# Altium schematic sheet circuit_BLDCControl.SchDoc
size 420 x 297 mm; Address1: Address1; Address2: Address2; Address3: Address3; Address4: Address4; SheetNumber: 1; Scale: 1:1; Разраб.: Лепотенко А.С.; Обозначение документа: ЛАС.42853.001Э3; Перв. применение: ЛАС.42853.001Э3; Наименование изделия 1: Блок управления BLDC; Наименование изделия 2: Схема электрическая; Наименование изделия 3: принципиальная; Нач. отд.: Нач. отд.
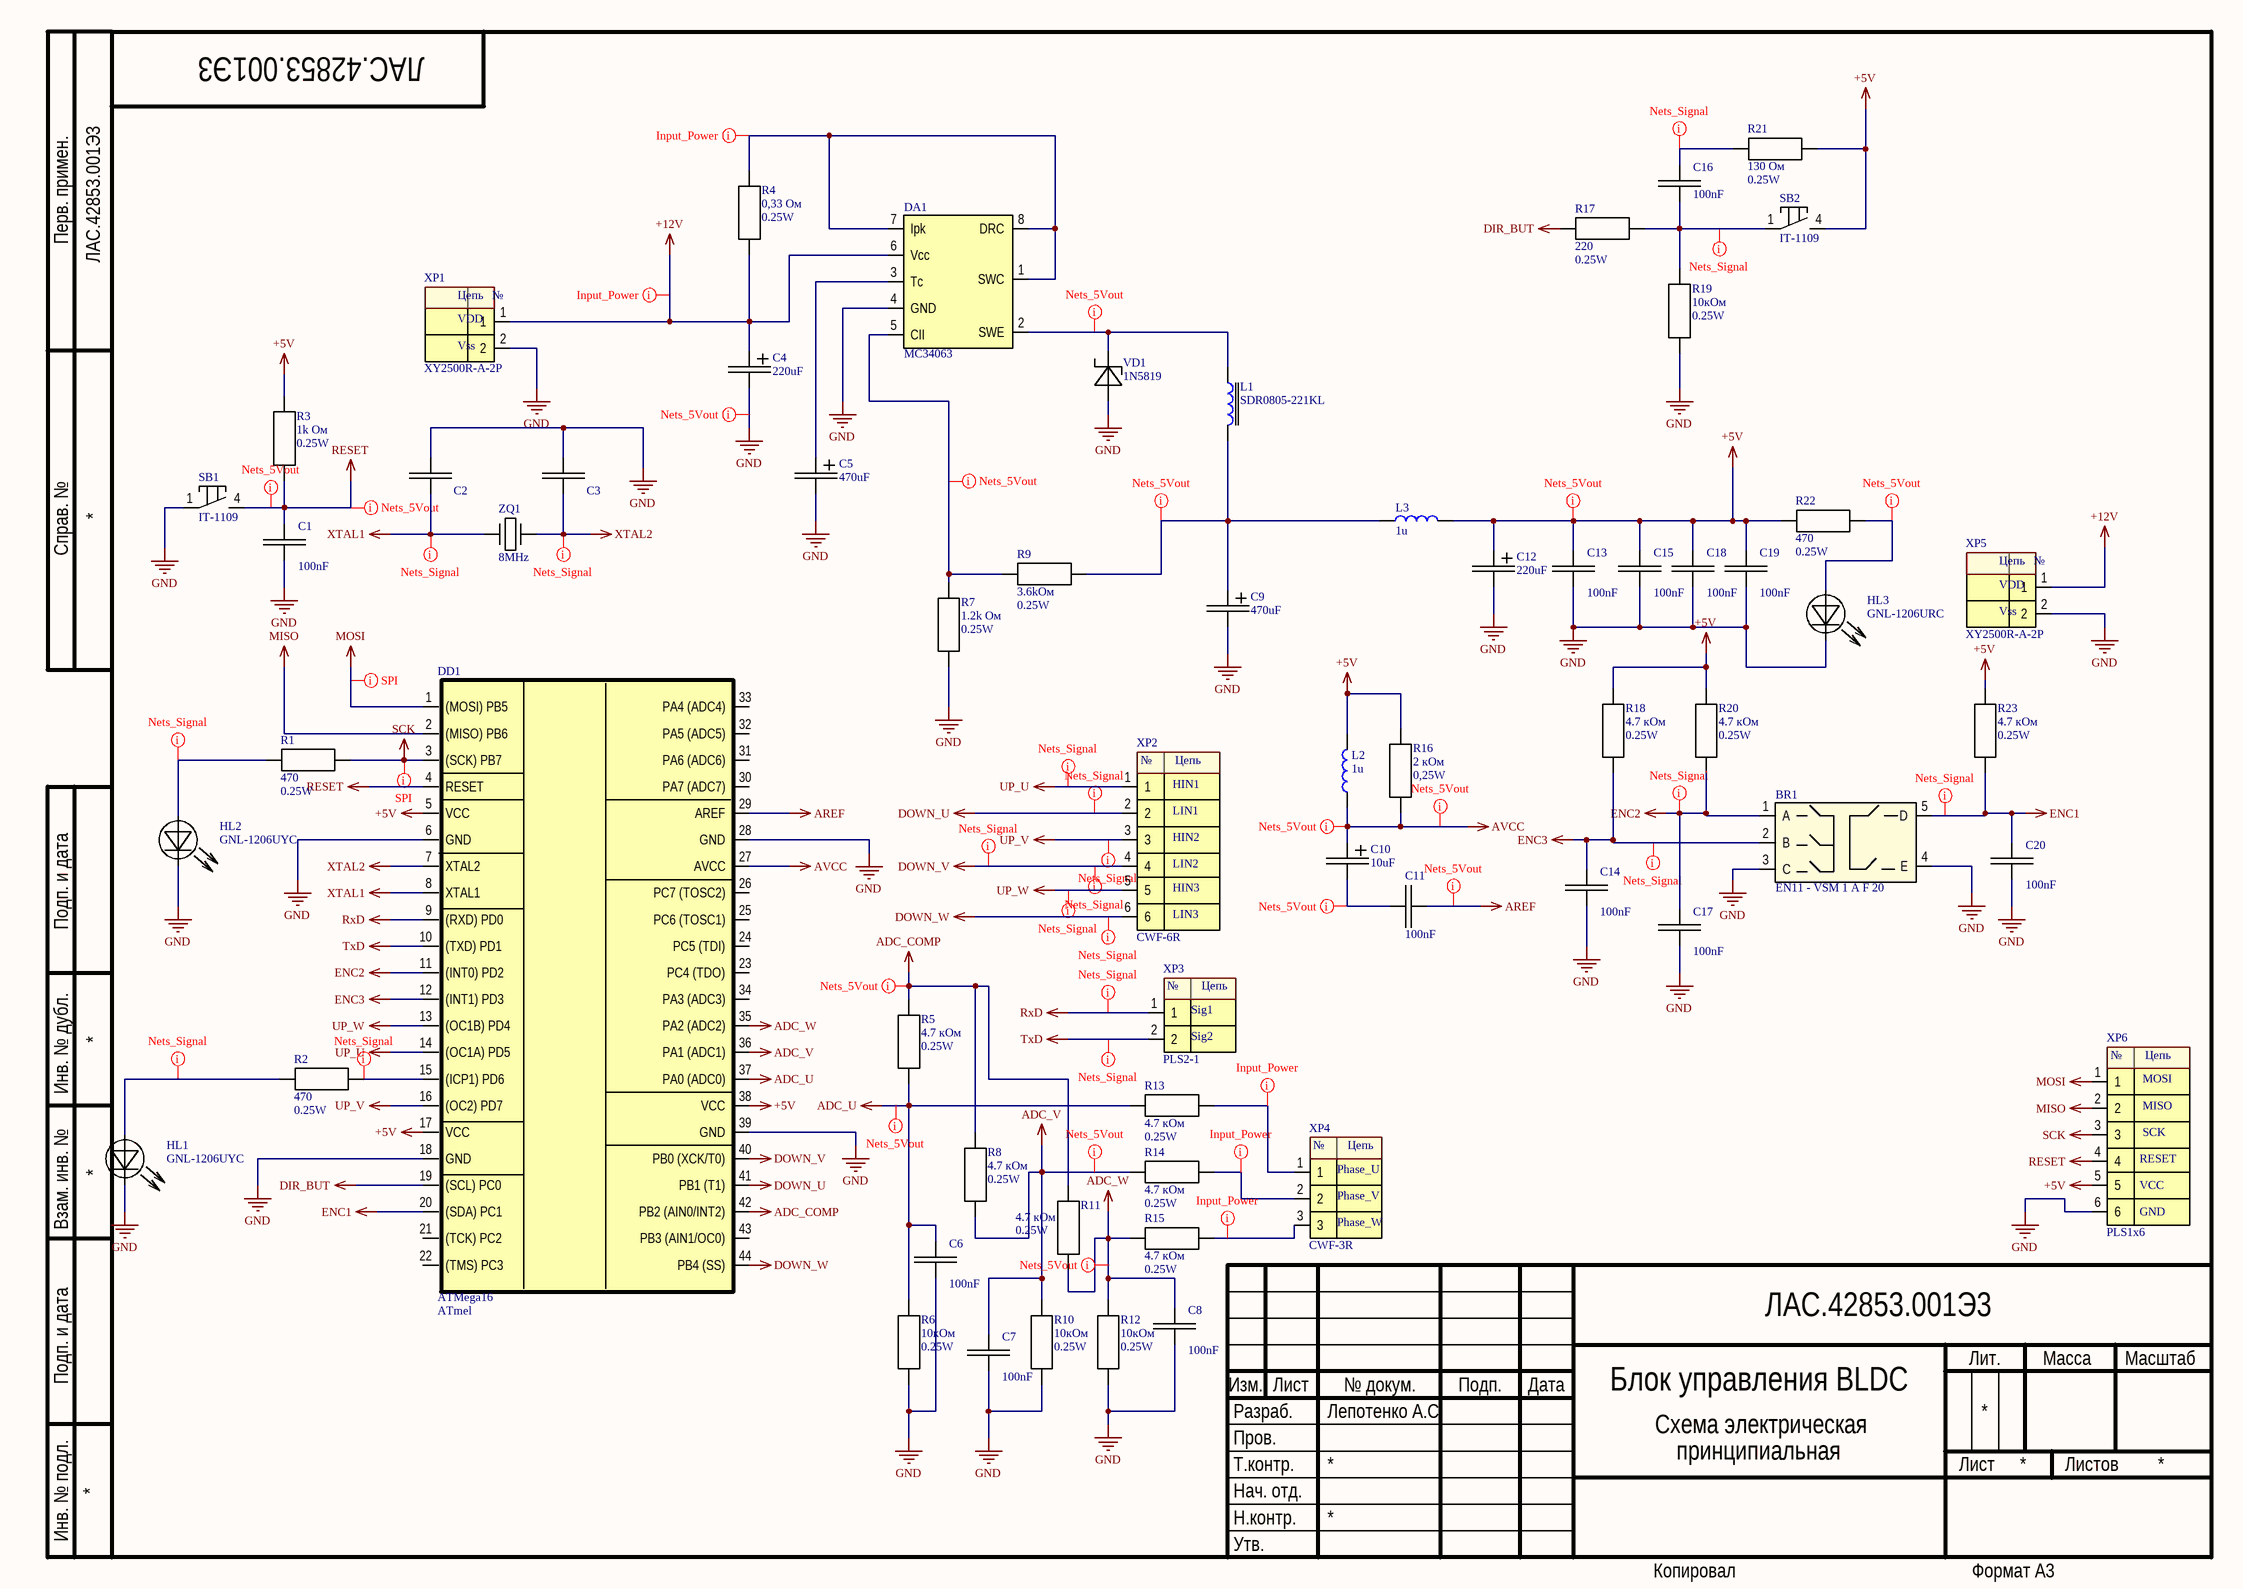
[diagram p0: circuit_BLDCControl.SchDoc]

## Parts
BR1  EN11 - VSM 1 A F 20  [EN11-HSM]
C1  100nF  [CAP1206]
C2  22pF  [CAP1206]  (value not drawn)
C3  22pF  [CAP1206]  (value not drawn)
C4  220uF  [CAPAE120103X105MTypeG]
C5  470uF  [CAPAE120103X105MTypeG]
C6  100nF  [CAP1206]
C7  100nF  [CAP1206]
C8  100nF  [CAP1206]
C9  470uF  [CAPAE120103X105MTypeG]
C10  10uF  [Type D]
C11  100nF  [CAP1206]
C12  220uF  [CAPAE120103X105MTypeG]
C13  100nF  [CAP1206]
C14  100nF  [CAP1206]
C15  100nF  [CAP1206]
C16  100nF  [CAP1206]
C17  100nF  [CAP1206]
C18  100nF  [CAP1206]
C19  100nF  [CAP1206]
C20  100nF  [CAP1206]
DA1  MC34063  [SO-8]
DD1  Manufacturer: ATmel  [TQFP80P1200X1200X120-44N]  (hidden comment: ATMega16)
HL1  GNL-1206UYC  [LED1206]
HL2  GNL-1206UYC  [LED1206]
HL3  GNL-1206URC  [LED1206]
L1  SDR0805-221KL  [SDR0805]
L2  1u  [LQG15HN15NJ]
L3  1u  [LQG15HN15NJ]
R1  Power: 0.25W  [1206]  (hidden comment: 470)
R2  Power: 0.25W  [1206]  (hidden comment: 470)
R3  Power: 0.25W  [1206]  (hidden comment: 1k Ом)
R4  Power: 0.25W  [1206]  (hidden comment: 0,33 Ом)
R5  Power: 0.25W  [1206]  (hidden comment: 4.7 кОм)
R6  Power: 0.25W  [1206]  (hidden comment: 10кОм)
R7  Power: 0.25W  [1206]  (hidden comment: 1.2k Ом)
R8  Power: 0.25W  [1206]  (hidden comment: 4.7 кОм)
R9  Power: 0.25W  [1206]  (hidden comment: 3.6kОм)
R10  Power: 0.25W  [1206]  (hidden comment: 10кОм)
R11  Power: 0.25W  [1206]  (hidden comment: 4.7 кОм)
R12  Power: 0.25W  [1206]  (hidden comment: 10кОм)
R13  Power: 0.25W  [1206]  (hidden comment: 4.7 кОм)
R14  Power: 0.25W  [1206]  (hidden comment: 4.7 кОм)
R15  Power: 0.25W  [1206]  (hidden comment: 4.7 кОм)
R16  Power: 0,25W  [1206]  (hidden comment: 2 кОм)
R17  Power: 0.25W  [1206]  (hidden comment: 220)
R18  Power: 0.25W  [1206]  (hidden comment: 4.7 кОм)
R19  Power: 0.25W  [1206]  (hidden comment: 10кОм)
R20  Power: 0.25W  [1206]  (hidden comment: 4.7 кОм)
R21  Power: 0.25W  [1206]  (hidden comment: 130 Ом)
R22  Power: 0.25W  [1206]  (hidden comment: 470)
R23  Power: 0.25W  [1206]  (hidden comment: 4.7 кОм)
SB1  IT-1109  [KLS2]
SB2  IT-1109  [KLS2]
VD1  1N5819  [DO-41-V]
XP1  XY2500R-A-2P  [KLS2-EDR-500-2P]
XP2  CWF-6R  [CWF-6R]
XP3  PLS2-1  [PLS-2-1]
XP4  CWF-3R  [CWF-3R]
XP5  XY2500R-A-2P  [KLS2-EDR-500-2P]
XP6  PLS1x6  [PLS1x6]
ZQ1  8MHz  [HC49-S]

## Nets
+5V: C12.1 C13.1 C15.1 C18.1 C19.1 DD1.5(VCC) DD1.17(VCC) DD1.38(VCC) L2.2 L3.2 R3.2 R16.2 R18.2 R20.2 R21.2 R22.2 R23.2 SB2.4 XP6.5
+12V: C4.1 DA1.6(Vcc) R4.1 XP1.1 XP5.1
ADC_COMP: DD1.42(PB2_(AIN0/INT2)) R5.1 R8.1 R11.1
ADC_U: C6.1 DD1.37(PA0_(ADC0)) R5.2 R6.1 R13.2
ADC_V: C7.1 DD1.36(PA1_(ADC1)) R8.2 R10.1 R14.2
ADC_W: C8.1 DD1.35(PA2_(ADC2)) R11.2 R12.1 R15.2
AREF: C11.2 DD1.29(AREF)
AVCC: C10.1 DD1.27(AVCC) L2.1 R16.1
DIR_BUT: DD1.19((SCL)_PC0) R17.1
DOWN_U: DD1.41(PB1_(T1)) XP2.2
DOWN_V: DD1.40(PB0_(XCK/T0)) XP2.4
DOWN_W: DD1.44(PB4_(SS)) XP2.6
ENC1: BR1.5(D) C20.1 DD1.20((SDA)_PC1) R23.1
ENC2: BR1.1(A) C17.1 DD1.11((INT0)_PD2) R20.1
ENC3: BR1.2(B) C14.1 DD1.12((INT1)_PD3) R18.1
GND: BR1.3(C) BR1.4(E) C1.2 C2.1 C3.1 C4.2 C5.2 C6.2 C7.2 C8.2 C9.2 C12.2 C13.2 C14.2 C15.2 C17.2 C18.2 C19.2 C20.2 DA1.4(GND) DD1.6(GND) DD1.18(GND) DD1.28(GND) DD1.39(GND) HL1.2 HL2.2 HL3.2 R6.2 R7.1 R10.2 R12.2 R19.1 SB1.1 VD1.1 XP1.2 XP5.2 XP6.6
MISO: DD1.2((MISO)_PB6) XP6.2
MOSI: DD1.1((MOSI)_PB5) XP6.1
RESET: C1.1 DD1.4(RESET) R3.1 SB1.4 XP6.4
RxD: DD1.9((RXD)_PD0) XP3.1
SCK: DD1.3((SCK)_PB7) R1.1 XP6.3
TxD: DD1.10((TXD)_PD1) XP3.2
UP_U: DD1.14((OC1A)_PD5) XP2.1
UP_V: DD1.16((OC2)_PD7) XP2.3
UP_W: DD1.13((OC1B)_PD4) XP2.5
XTAL1: C2.2 DD1.8(XTAL1) ZQ1.1
XTAL2: C3.2 DD1.7(XTAL2) ZQ1.3
NetC5_1: C5.1 DA1.3(Tc)
NetC9_1: C9.1 L1.2 L3.1 R9.2
NetC10_2: C10.2 C11.1
NetC16_1: C16.1 R21.1
NetC16_2: C16.2 R17.2 R19.2 SB2.1
NetDA1_1: DA1.1(SWC) DA1.7(Ipk) DA1.8(DRC) R4.2
NetDA1_2: DA1.2(SWE) L1.1 VD1.2
NetDA1_5: DA1.5(CII) R7.2 R9.1
NetDD1_15: DD1.15((ICP1)_PD6) R2.1
NetHL1_1: HL1.1 R2.2
NetHL2_1: HL2.1 R1.2
NetHL3_1: HL3.1 R22.1
NetR13_1: R13.1 XP4.1
NetR14_1: R14.1 XP4.2
NetR15_1: R15.1 XP4.3

Not connected (* = marked no-connect by the designer): DD1 21((TCK)_PC2) 22((TMS)_PC3) 23(PC4_(TDO)) 24(PC5_(TDI)) 25(PC6_(TOSC1)) 26(PC7_(TOSC2)) 30(PA7_(ADC7)) 31(PA6_(ADC6)) 32(PA5_(ADC5)) 33(PA4_(ADC4)) 34(PA3_(ADC3)) 43(PB3_(AIN1/OC0))

## Layout directives
net class Input_Power: +12V, NetDA1_1, NetR13_1, NetR14_1, NetR15_1
net class Nets_5Vout: +5V, ADC_COMP, ADC_U, ADC_V, ADC_W, AREF, AVCC, GND, NetC9_1, NetC10_2, NetDA1_2, NetDA1_5, NetHL3_1, RESET
net class Nets_Signal: DOWN_U, DOWN_V, DOWN_W, ENC1, ENC2, ENC3, NetC16_1, NetC16_2, NetDD1_15, NetHL1_1, NetHL2_1, RxD, TxD, UP_U, UP_V, UP_W, XTAL1, XTAL2
net class SPI_Prog: MOSI, SCK

## Notes on the sheet
- Перв. примен.
- Справ. №
- Подп. и дата
- Инв. № дубл.
- Взам. инв. №
- Разраб.
- Изм.
- Лист
- № докум.
- Подп.
- Дата
- Лит.
- Масса
- Масштаб
- Пров.
- Т.контр.
- Листов
- Инв. № подл.
- Утв.
- Н.контр.
- Копировал
- Формат А3
- (in symbol Connector_Power) Цепь; №; VDD; Vss
- (in symbol CWF-3R) №; Цепь; Phase_U; Phase_V; Phase_W
- (in symbol CWF-6R) №; Цепь; HIN1; LIN1; HIN2; LIN2; HIN3; LIN3
- (in symbol PLS1x6) №; Цепь; MOSI; MISO; SCK; RESET; VCC; GND
- (in symbol PLS2-1) №; Цепь; Sig1; Sig2

## Library data of the parts
BR1 = Encoder: Manufacturer: TTelectronics; Package: CWF-3R; Part Number: EN11 - VSM 1 A F 20; Value: *; Quantity: 3; Price: 0.05; ShoppingPlace: http://belchip.by/product/?selected_product=17773; Documentation: http://belchip.by/sitedocs/18676.pdf
C1 C6-C8 C11 C13-C20 = Capasitor: Part Number: CL31B104KBCNNNC; Manufacturer: Samsung; Voltage: 50V; Value: 100nF; Quantity: 4; Package: 1206; Price: 0,035; ShoppingPlace: http://belchip.by/product/?selected_product=31093
C2 C3 = Capasitor: Part Number: NPO-50V; Manufacturer: Samsung; Voltage: 50V; Value: 22pF; Quantity: 2; Package: 1206; Price: 0.025; ShoppingPlace: http://belchip.by/product/?selected_product=00259
C4 C12 = Capasitor Electrolit: Part Number: 220uF 35V 10x10; Manufacturer: Китай; Power: 10V; Value: 220uF; Price: 1; ShoppingPlace: http://belchip.by/product/?selected_product=32976; Package: 10x10; Quantity: 3; Documentation: http://belchip.by/product/?selected_product=32976
C5 C9 = Capasitor Electrolit: Part Number: B41121A3477M000; Manufacturer: EPCOS; Power: 25V; Value: 470uF; Price: 2; ShoppingPlace: https://www.ru-chipdip.by/product/b41121a3477m000; Package: 8x10; Documentation: https://static.chipdip.ru/lib/051/DOC000051935.pdf
C10 = Capasitor Electrolit: Part Number: D 10uF 25V 20; Manufacturer: Vishay; Power: 25V; Value: 10uF; Price: 0,23; ShoppingPlace: http://belchip.by/product/?selected_product=00096; Package: TypeD
DA1 = MC34063: Manufacturer: ON Semiconductor; part Number: MC34063; Package: SO-8; Price: 0,3; ShoppingPlace: http://belchip.by/product/?selected_product=28823; Quantity: 1
DD1 = ATMega 16: Package: TQFP44; Value: ATMega16; Documentation: http://belchip.by/sitedocs/00002095.pdf; Price: 5,2; ShoppingPlace: http://belchip.by/product/?selected_product=02095; Quantity: 1; Part Number: ATMega16
HL1 HL2 = LED: Manufacturer: G-NOR; Value: YELLOW; Part Number: GNL-1206UYC; Price: 0.06; Package: 1206; Quantity: 6; ShoppingPlace: http://belchip.by/product/?selected_product=00949
HL3 = LED: Manufacturer: G-NOR; Value: RED; Part Number: GNL-1206URC; Price: 0.06; Package: 1206; Quantity: 6; ShoppingPlace: http://belchip.by/product/?selected_product=00953
L1 = Induc_SD1105: Manufacturer: BOURNS; Value: 220uH; Part Number: SDR0805-221KL; ShoppingPlace: https://www.ru-chipdip.by/product/sdr1105-201k; Price: 1; Package: SDR0805; Quantity: 1; Documentation: http://docs-europe.electrocomponents.com/webdocs/150d/0900766b8150ddf1.pdf
L2 L3 = Inductor: Part Number: CM453232-1R0KL; Manufacturer: Bourns; Value: 1u; ShoppingPlace: https://www.ru-chipdip.by/product/cm453232-1r0kl; Price: 0.225; Package: 1812; Quantity: 2
R1 R2 R22 = Resistor: Manufacturer: YAGEO; Part Number: RC1206JR-07470RL; Quntity: 3; Price: 0.15; Package: 1206; ShoppingPlace: http://belchip.by/product/?selected_product=32449; Value: 470
R3 = Resistor: Manufacturer: Royal Ohm; Part Number: RC1206FR-071KL; Quntity: 1; Price: 0,02; Package: 1206; ShoppingPlace: http://belchip.by/product/?selected_product=19295; Value: 1k Ом
R4 = Resistor: Manufacturer: Royal Ohm; Part Number: RC1206FR-12060R33; Quntity: 1; Price: 0,5; Package: 1206; ShoppingPlace: http://belchip.by/product/?selected_product=32979; Value: 0,33 Ом; Documentation: http://belchip.by/sitedocs/18520.pdf
R5 R6 R8 R10-R15 R18 R20 R23 = Resistor: Manufacturer: YAGEO; Part Number: RC1206JR-074K7L; Quntity: 4; Price: 0,15; Package: 1206; ShoppingPlace: http://belchip.by/product/?selected_product=01399
  R5 R8 R11 R13-R15 R18 R20 R23: Value: 4.7 кОм
  R6 R10 R12: Value: 10кОм
R7 = Resistor: Manufacturer: РФ; Part Number: 1206 1.2K; Quntity: 1; Price: 0,15; Package: 1206; ShoppingPlace: http://belchip.by/product/?selected_product=01386; Value: 1.2k Ом
R9 = Resistor: Manufacturer: РФ; Part Number: 1206 3.6K; Quntity: 1; Price: 1; Package: 1206; ShoppingPlace: http://belchip.by/product/?selected_product=01396; Value: 3.6kОм
R16 = Resistor: Manufacturer: РФ; Part Number: SMD 1206 2K; Quntity: 1; Price: 0,15; Package: 1206; ShoppingPlace: http://belchip.by/product/?selected_product=01391; Value: 2 кОм
R17 = Resistor: Manufacturer: Royal Ohm; Part Number: HP06-220R5; Quntity: 1; Price: 0,02; Package: 1206; ShoppingPlace: http://belchip.by/product/?selected_product=06325; Value: 220
R19 = Resistor: Manufacturer: YAGEO; Part Number: RC1206JR-0710KL; Quntity: 1; Price: 0.15; Package: 1206; ShoppingPlace: http://belchip.by/product/?selected_product=31101; Value: 10кОм
R21 = Resistor: Manufacturer: RF; Part Number: 130R; Quntity: 1; Price: 0,15; Package: 1206; ShoppingPlace: http://belchip.by/product/?selected_product=01363; Value: 130 Ом
SB1 SB2 = Button: Manufacturer: RUICHI; Part Number: IT-1109; Price: 0,1; ShoppingPlace: http://belchip.by/product/?selected_product=03267; Quantity: 2; Package: 4,5x4,5x3,8
VD1 = 1N5819: Manufacturer: GALAXY; Value: 40V; Power: 1A; Price: 0.12; ShoppingPlace: http://belchip.by/product/?selected_product=08853; Package: SOD-123; Quantity: 3; Documentation: *; Part Number: 1N5819
XP1 XP5 = Connector_Power: Manufacturer: РБ; Value: 1000V; Package: XY2500R-A-2P; Part Number: XY2500R-A-2P; Quantity: 2; Price: 0,10; ShoppingPlace: http://belchip.by/product/?selected_product=14514
XP2 = CWF-6R: Manufacturer: KLS; Part Number: CWF-6R; Quantity: 1; Price: 1; shoppingPlace: http://belchip.by/product/?selected_product=32444
XP3 = PLS2-1: Manufacturer: KLS; Package: PLS2-1; Part Number: PLS2-1; Value: *; Quantity: 3; Price: 0.05; ShoppingPlace: http://belchip.by/product/?selected_product=31993
XP4 = CWF-3R: Manufacturer: KLS; Package: CWF-3R; Part Number: CWF-3R; Value: *; Quantity: 3; Price: 0.05; ShoppingPlace: http://belchip.by/product/?selected_product=32444
XP6 = PLS1x6: Part Number: KLS1x6; Manufacturer: KLS; Quantity: 1; value: *; Price: 1; shoppingPlace: http://belchip.by/product/?selected_product=02010
ZQ1 = Rzanator: Part Number: HC49US-FF5F8.0000; Manufacturer: CHina; Value: 8MHz; Package: HC-51; Quantity: 1; Price: 0,37; ShoppingPlace: http://belchip.by/product/?selected_product=04623